# EAGLE schematic SUB-UNIT (EAGLE 9.6.2)
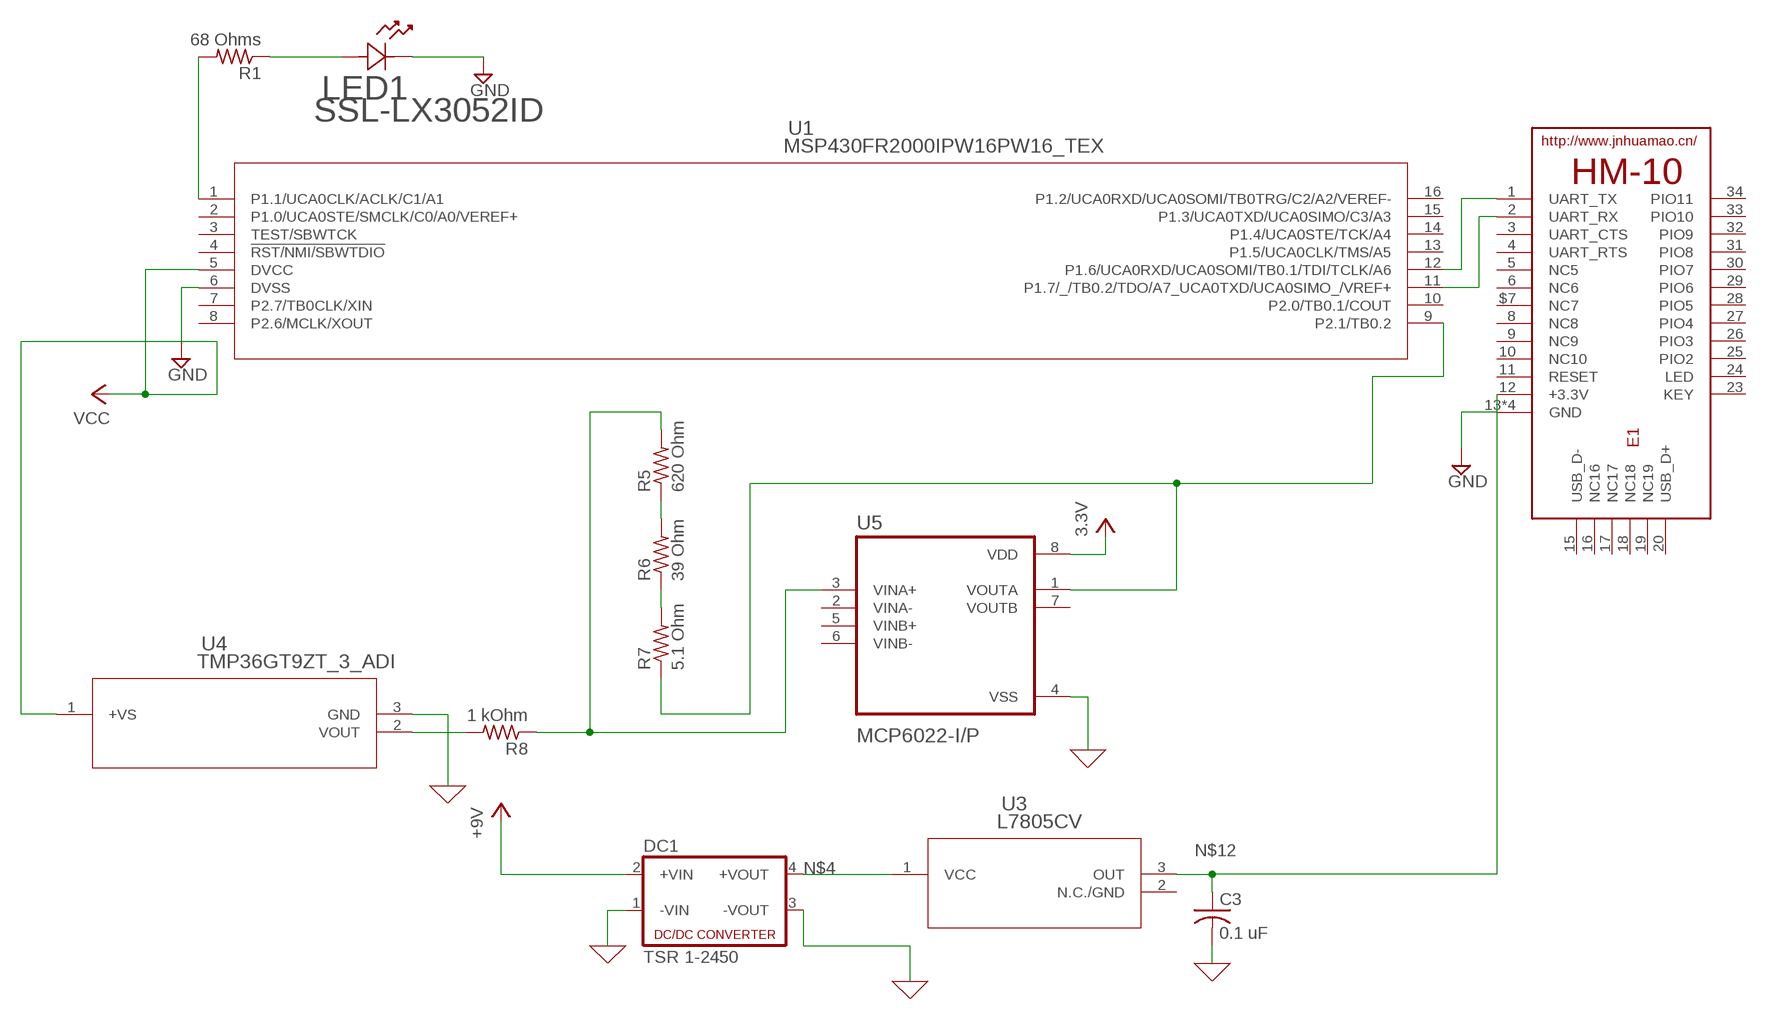
[diagram p0: schematic, sheet 1]

## Parts
C3  0.1 uF  C-US050-024X044  [C050-024X044]
DC1  TSR 1-2450  NME  [NME]
E1  HM-10-BOARD  [26.9X13X2.2_BOARD]
LED1  SSL-LX3052ID  [LED_SSL-LX30_T-3_LUM]
R1  68 Ohms  R-US_0204/5  [0204/5]
R5  620 Ohm  R-US_0204/7  [0204/7]
R6  39 Ohm  R-US_0204/7  [0204/7]
R7  5.1 Ohm  R-US_0204/7  [0204/7]
R8  1 kOhm  R-US_0204/7  [0204/7]
U1  MSP430FR2000IPW16PW16_TEX  [PW16_TEX]
U3  L7805CV  BA033CC0FP-E2TO252-3_ROM  [TO252-3_ROM]
U4  TMP36GT9ZT_3_ADI  [T_3_ADI]
U5  MCP6022-I/P  [DIP787W46P254L927H533Q8]

## Nets
0: C3.2 DC1.1(-VIN) DC1.3(-VOUT) U4.3(GND) U5.4(VSS) ; supply symbol labelled GND
+5V: DC1.2(+VIN) ; supply symbol labelled +9V
GND: E1.13(GND) E1.14(GND) E1.21(GND) E1.22(GND) LED1.1(ANODE) U1.6(DVSS)
N$1: LED1.2 R1.1
N$2: E1.1(UART_TX) U1.12(P1.6/UCA0RXD/UCA0SOMI/TB0.1/TDI/TCLK/A6)
N$3: E1.2(UART_RX) U1.11(P1.7/_/TB0.2/TDO/A7_UCA0TXD/UCA0SIMO_/VREF+)
N$4: DC1.4(+VOUT) R1.2 U1.1(P1.1/UCA0CLK/ACLK/C1/A1) U3.1(VCC)
N$5: R7.1 U1.9(P2.1/TB0.2) U5.1(VOUTA)
N$6: R8.2 U4.2(VOUT)
N$9: R6.1 R7.2
N$10: R5.1 R6.2
N$12: C3.1 E1.12(+3.3V) R5.2 R8.1 U3.3(OUT) U5.3(VINA+)
VCC: U1.5(DVCC) U4.1(+VS) U5.8(VDD) ; supply symbol labelled 3.3V
Unconnected: E1.3(UART_CTS) E1.4(UART_RTS) E1.5(NC5) E1.6(NC6) E1.8(NC8) E1.9(NC9) E1.10(NC10) E1.11(RESET) E1.15(USB_D-) E1.16(NC16) E1.17(NC17) E1.18(NC18) E1.19(NC19) E1.20(USB_D+) E1.23(KEY) E1.24(LED) E1.25(PIO2) E1.26(PIO3) E1.27(PIO4) E1.28(PIO5) E1.29(PIO6) E1.30(PIO7) E1.31(PIO8) E1.32(PIO9) E1.33(PIO10) E1.34(PIO11) E1.$7(NC7) U1.2(P1.0/UCA0STE/SMCLK/C0/A0/VEREF+) U1.3(TEST/SBWTCK) U1.4(!RST/NMI/SBWTDIO) U1.7(P2.7/TB0CLK/XIN) U1.8(P2.6/MCLK/XOUT) U1.10(P2.0/TB0.1/COUT) U1.13(P1.5/UCA0CLK/TMS/A5) U1.14(P1.4/UCA0STE/TCK/A4) U1.15(P1.3/UCA0TXD/UCA0SIMO/C3/A3) U1.16(P1.2/UCA0RXD/UCA0SOMI/TB0TRG/C2/A2/VEREF-) U3.2(N.C./GND) U5.2(VINA-) U5.5(VINB+) U5.6(VINB-) U5.7(VOUTB)

## Library data of the parts
C3 = rcl:C-US: CAPACITOR, American symbol; SPICEPREFIX: C
DC1 = dc-dc-converter:NME: DC-DC CONVERTER; MF: C & D TECHNOLOGIES, INC; MPN: NME1205D; OC_FARNELL: 1021466; OC_NEWARK: 98B8198
E1 = HM-10 Bluetooth Module:HM-10: HM Bluetooth module use TI CC2540 or CC2541, Master and slave roles in one, transmission version and remote control version and PIO state acquisition functions in one, Support the AT command modify module parameters, Convenient and flexible. Check availability <https://pricing.snapeda.com/parts/HM-10/Jinan%20Huamao%20Technology/view-part?ref=eda>; AVAILABILITY: Not in stock; DESCRIPTION: Bluetooth 4.0 module with 4pin base board that can support iphone4s or later.; MF: Jinan Huamao Technology; MP: HM-10; PACKAGE: Package; PRICE: None
LED1 = Lumex SSL-LX3052ID RED LED:SSL-LX3052ID; COPYRIGHT: Copyright (C) 2023 Ultra Librarian. All rights reserved.; MANUFACTURER_PART_NUMBER: SSL-LX3052ID; MFR_NAME: Lumex
R1 = adafruit:R-US_: RESISTOR, American symbol
R5-R8 = rcl:R-US_: RESISTOR, American symbol; SPICEPREFIX: R
U1 = MSP430FR2000 Sub-Unit:MSP430FR2000IPW16; COPYRIGHT: Copyright (C) 2023 Ultra Librarian. All rights reserved.; MANUFACTURER_PART_NUMBER: MSP430FR2000IPW16; MFR_NAME: Texas Instruments
U3 = 2023-03-08_12-17-23_Library:BA033CC0FP-E2; COPYRIGHT: Copyright (C) 2023 Ultra Librarian. All rights reserved.; DIGI-KEY_PART_NUMBER_1: BA033CC0FP-E2TR-ND; DIGI-KEY_PART_NUMBER_2: BA033CC0FP-E2CT-ND; DIGI-KEY_PART_NUMBER_3: BA033CC0FP-E2DKR-ND; MANUFACTURER_PART_NUMBER: BA033CC0FP-E2; MFR_NAME: ROHM Semiconductor
U4 = 2023-03-28_14-12-25_Library:TMP36GT9Z; COPYRIGHT: Copyright (C) 2023 Ultra Librarian. All rights reserved.; DIGI-KEY_PART_NUMBER_1: TMP36GT9Z-ND; DIGI-KEY_PART_NUMBER_2: 2156-TMP36GT9Z-ND; MANUFACTURER_PART_NUMBER: TMP36GT9Z; MFR_NAME: Analog Devices Inc
U5 = MCP6022-I_P:MCP6022-I/P